# EAGLE design NodeMCUDisplayShield (EAGLE 8.3.1)
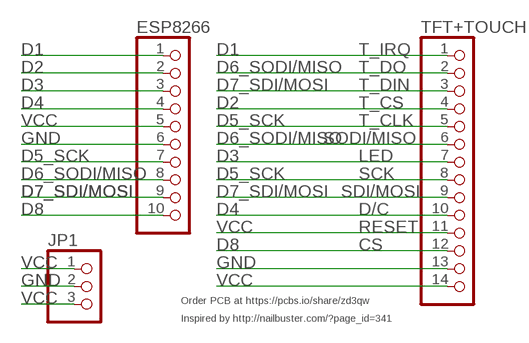
[diagram p0: schematic, sheet 1]

## Parts
ESP8266  PINHD-1X10/OCT  [1X10/OCT]
JP1  PINHD-1X3/OCT  [1X03/OCT]
TFT+TOUCH  PINHD-1X14/OCT  [1X14/OCT]

## Nets
D1: ESP8266.1 TFT+TOUCH.1
D2: ESP8266.2 TFT+TOUCH.4
D3 [power]: ESP8266.3 TFT+TOUCH.7
D4: ESP8266.4 TFT+TOUCH.10
D5_SCK: ESP8266.7 TFT+TOUCH.5 TFT+TOUCH.8
D6_SODI/MISO: ESP8266.8 TFT+TOUCH.2 TFT+TOUCH.6
D7_SDI/MOSI: ESP8266.9 TFT+TOUCH.3 TFT+TOUCH.9
D8: ESP8266.10 TFT+TOUCH.12
GND [power]: ESP8266.6 JP1.2 TFT+TOUCH.13
VCC [power]: ESP8266.5 JP1.1 JP1.3 TFT+TOUCH.11 TFT+TOUCH.14

## Notes on the sheet
- T_IRQ
- T_DO
- T_DIN
- T_CS
- T_CLK
- SODI/MISO
- LED
- SCK
- SDI/MOSI
- D/C
- RESET
- CS
- Order PCB at https://pcbs.io/share/zd3qw
- Inspired by http://nailbuster.com/?page_id=341

## Library data of the parts
ESP8266 = pinhead_v2:PINHD-1X10: PIN HEADER
JP1 = pinhead_v2:PINHD-1X3: PIN HEADER
TFT+TOUCH = pinhead_v2:PINHD-1X14: PIN HEADER

## Net classes
0 default: clearance 0.127 mm
1 power: width 0.381 mm, clearance 0.127 mm

## Board
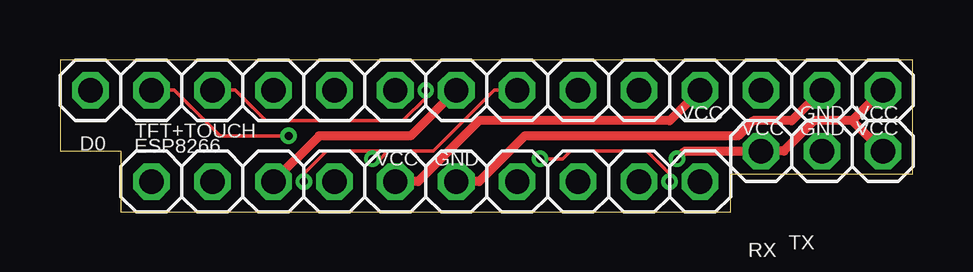
[diagram p1: board, top side]
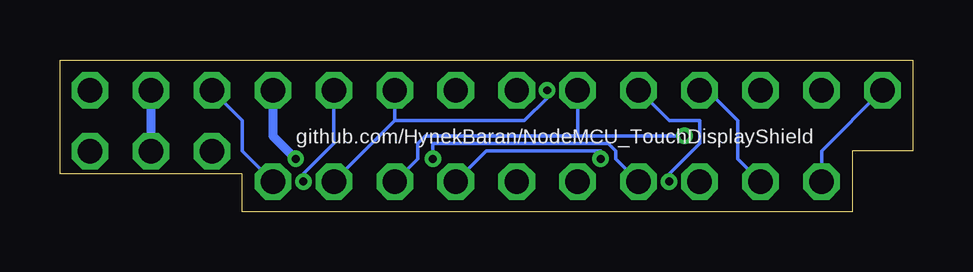
[diagram p2: board, bottom side, seen from below]

Size 35.54 x 6.35 mm. Coordinates in mm from the lower left corner, seen from the top.
Outline: 2.54,0 27.94,0 27.94,1.59 35.54,1.59 35.54,6.35 0,6.35 0,2.54 2.54,2.54 2.54,0
Copper layers (1*16): Top 0.0356mm / dielectric 1.5011mm / Bottom 0.0356mm
Design rules "PCBs_io": minimum track width 6mil, minimum drill 13mil, track to track 6mil, track to pad 6mil, pad to pad 6mil, via to via 6mil, smd to smd 6mil, copper to edge 15mil, drill to drill 6mil, minimum pad ring 7mil, minimum via ring 7mil, stop-mask expansion 3mil, vias tented up to drill 0mil, thermal gap 10mil

### Footprints (pad centres in the part's own frame; a part is rotated, then mirrored left to right if it is on the bottom)
1X10/OCT = drill 1.016 octagon: 1 -11.43,0; 2 -8.89,0; 3 -6.35,0; 4 -3.81,0; 5 -1.27,0; 6 1.27,0; 7 3.81,0; 8 6.35,0; 9 8.89,0; 10 11.43,0
1X03/OCT = drill 1.016 octagon: 1 -2.54,0; 2 0,0; 3 2.54,0
1X14/OCT = drill 1.016 octagon: 1 -16.51,0; 2 -13.97,0; 3 -11.43,0; 4 -8.89,0; 5 -6.35,0; 6 -3.81,0; 7 -1.27,0; 8 1.27,0; 9 3.81,0; 10 6.35,0; 11 8.89,0; 12 11.43,0; 13 13.97,0; 14 16.51,0

### Placement (x,y rotation side)
ESP8266  15.24,1.27 0 top
JP1  31.75,2.54 0 top
TFT+TOUCH  17.78,5.08 0 top

### Tracks (layer width: path | path; a pad name or v marks a point on that pad's centre or on a via)
D1
  Bottom 0.152: TFT+TOUCH.1 3.81,2.54 ESP8266.1
D2
  Bottom 0.152: ESP8266.2 7.3,2.22 7.3,3.81 8.57,5.08 TFT+TOUCH.4
D3
  Top 0.381: ESP8266.3 10.79,3.18 14.61,3.18 TFT+TOUCH.7
D4  (via drill 0.33)
  Top 0.152: v20,2.22 20.95,2.22 21.27,2.54 24.45,2.54 25.4,1.59 v25.4,1.27
  Bottom 0.152: ESP8266.4 12.38,2.22 12.38,2.54 12.7,2.86 20,2.86 v20,2.22 | v25.4,1.27 25.4,1.59 24.13,2.86 TFT+TOUCH.10
D5_SCK  (via drill 0.33)
  Top 0.152: v13.02,2.22 13.34,2.22 13.65,2.54 | 13.65,2.54 15.56,2.54 18.1,5.08 TFT+TOUCH.8 | v10.16,1.27 10.16,1.59 11.11,2.54 13.65,2.54
  Bottom 0.152: ESP8266.7 17.78,2.54 13.02,2.54 v13.02,2.22 | TFT+TOUCH.5 10.16,3.81 8.89,3.81 8.89,2.86 10.16,1.59 v10.16,1.27
D6_SODI/MISO  (via drill 0.33)
  Top 0.152: TFT+TOUCH.2 4.76,5.08 6.67,3.18 v9.53,3.18
  Bottom 0.152: 13.97,3.18 v9.53,3.18 | TFT+TOUCH.6 13.97,3.18 | ESP8266.8 20.64,2.22 20.64,2.86 20.32,3.18 13.97,3.18
D7_SDI/MOSI  (via drill 0.33)
  Top 0.152: TFT+TOUCH.3 7.3,5.08 8.57,3.81 14.29,3.81 15.24,4.76 v15.24,5.08
  Bottom 0.152: 21.59,3.81 ESP8266.9 | TFT+TOUCH.9 21.59,3.81 | v15.24,5.08 15.24,4.76 16.19,3.81 21.59,3.81
D8
  Bottom 0.152: ESP8266.10 27.94,2.54 27.94,3.81 TFT+TOUCH.12
GND
  Top 0.381: ESP8266.6 17.46,1.27 19.37,3.18 28.26,3.18 28.89,3.81 30.48,3.81 TFT+TOUCH.13
  Bottom 0.381: TFT+TOUCH.13 JP1.2
VCC  (via drill 0.33)
  Top 0.381: 33.02,3.81 31.43,3.81 30.16,2.54 JP1.1 26.04,2.54 v25.72,2.22 | TFT+TOUCH.14 33.02,3.81 | 33.02,3.81 JP1.3 | ESP8266.5 14.92,1.27 17.46,3.81 25.4,3.81 TFT+TOUCH.11
  Bottom 0.381: v25.72,2.22 26.67,3.18 TFT+TOUCH.11

### Text on the board
tNames: VCC | GND | VCC | VCC | GND | VCC | D0 | VCC | GND | RX | TX | GND
bNames: github.com/HynekBaran/NodeMCU_TouchDisplayShield